# EasyEDA Pro project stm32f401rct6v1.eprj, board STM32F401RCT6V1B
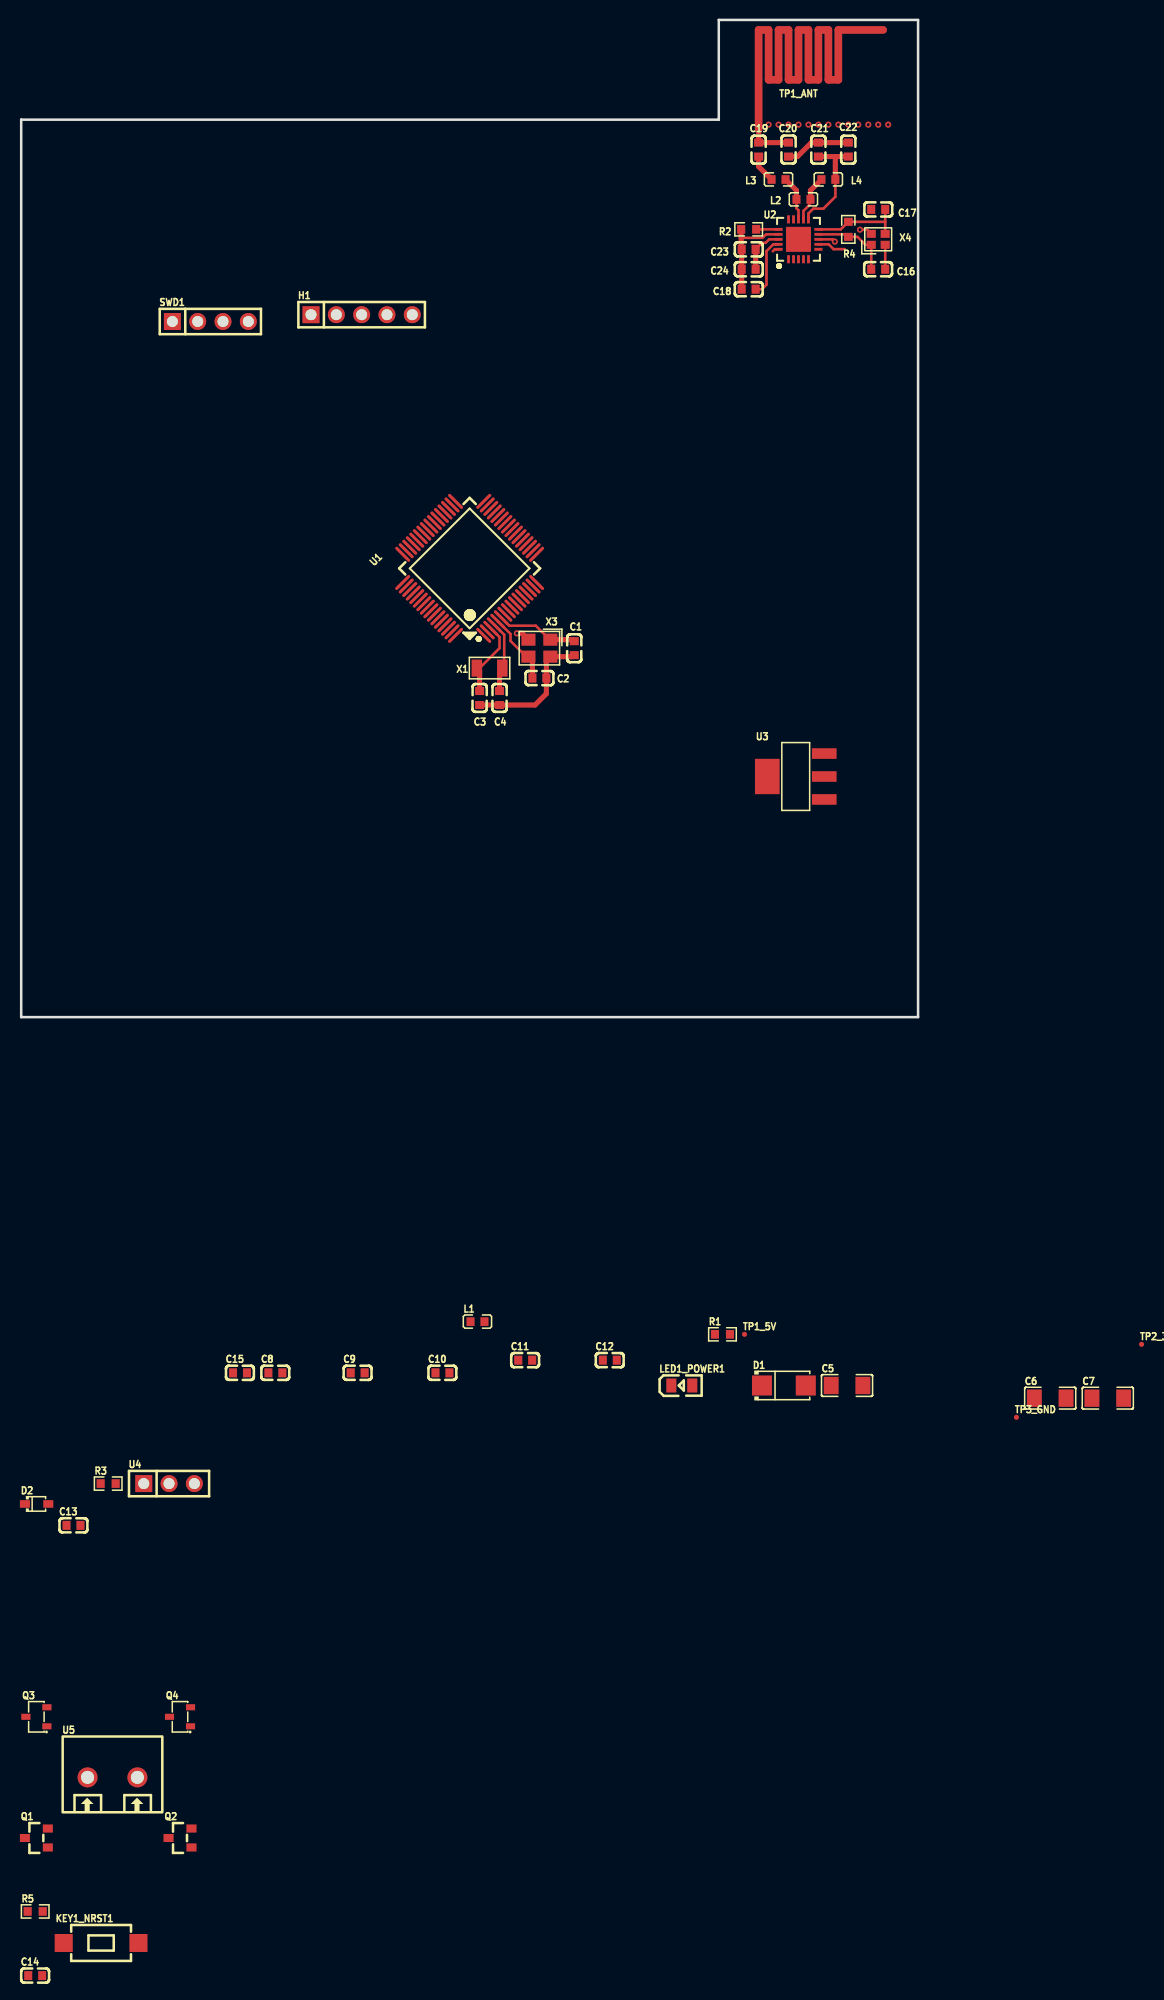
[diagram p5: board, top side]
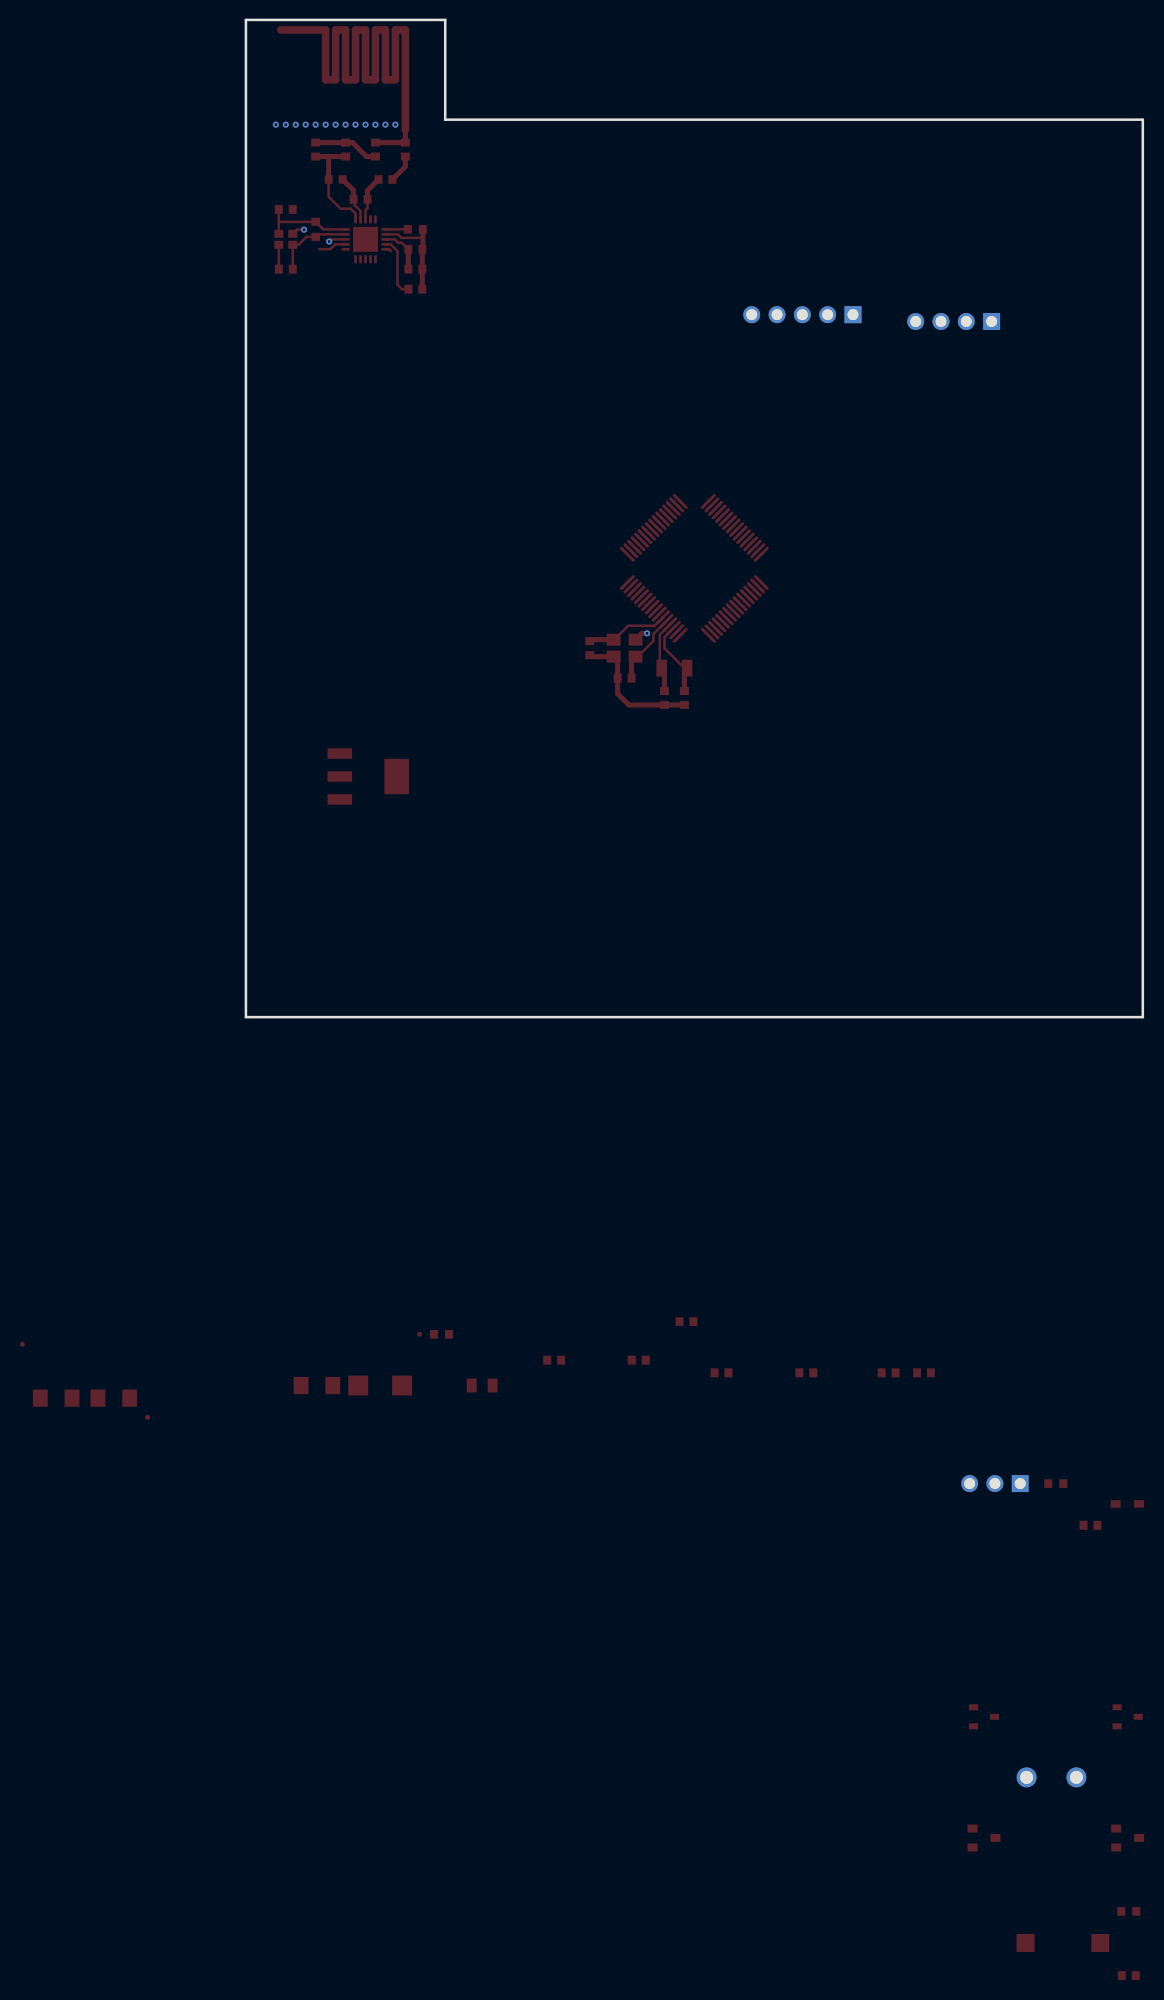
[diagram p6: board, bottom side, seen from below]

Outline 90 x 100 mm; copper layers: Top Layer, Bottom Layer. Coordinates in mm from the lower left corner of the outline.
Outline path: 0,90 70,90 70,100 90,100 90,0 0,0 0,90
Stack: Top Layer 0.035mm / Dielectric1 1.51mm FR4 er 4.5 / Bottom Layer 0.035mm

## Design rules (mm)
template: JLCPCB Capability(Two Layers Board)
spacing copperThickness1oz (default): track to track 0.102, other pairs 0.152 to 0.3
spacing copperThickness2oz: track to track 0.203, other pairs 0.152 to 0.3
track width copperThickness1oz (default): min 0.127, default 0.254, max 2.54
track width copperThickness2oz: min 0.203, default 0.254, max 2.54
differential pair differentialPair (default): width min 0.127, default 0.254, max 2.54; gap min 0.152, default 0.152
via viaSize (default): diameter min 0.5, default 0.61, max 10; hole min 0.3, default 0.305, max 6.3

## Placement (name value [footprint] x y rotation side)
C1  22pF  [C0603]  55.5 37 90 top
C2  22pF  [C0603]  52 34 180 top
C3  6pF  [C0603]  46 32 270 top
C4  6pF  [C0603]  48 32 270 top
C5  47uF  [C1206]  82.87 -36.94 0 top
C6  47uF  [C1206]  103.26 -38.21 0 top
C7  100nF  [C1206]  109.04 -38.21 0 top
C8  100nF  [C0603]  25.51 -35.67 0 top
C9  100nF  [C0603]  33.76 -35.67 0 top
C10  100nF  [C0603]  42.27 -35.67 0 top
C11  1uF  [C0603]  50.58 -34.4 0 top
C12  10nF  [C0603]  59.07 -34.4 0 top
C13  4.7uF  [C0603]  5.25 -50.97 0 top
C14  100nF  [C0603]  1.41 -96.12 0 top
C15  100nF  [C0603]  21.96 -35.67 0 top
C16  22pF  [C0603]  86 75 0 top
C17  22pF  [C0603]  86 81 180 top
C18  33nF  [C0603]  73 73 180 top
C19  1.5pF  [C0603]  74 87 90 top
C20  1pF  [C0603]  77 87 270 top
C21  4.7pF  [C0603]  80 87 90 top
C22  2.2nF  [C0603]  83 87 90 top
C23  10nF  [C0603]  73 77 180 top
C24  1nF  [C0603]  73 75 180 top
D1  SMAJ5.0A  [SMA_L4.3-W2.6-LS5.2-RD]  76.53 -36.94 0 top
D2  1N4148WS  [SOD-323_L1.8-W1.3-LS2.5-RD]  1.55 -48.82 0 top
H1  PZ254V-11-05P  [HDR-TH_5P-P2.54-V-M]  34.16 70.44 0 top
KEY1_NRST1  TC-3602-4.3-260G  [KEY-SMD_L6.0-W3.6-LS8.3-L]  8.02 -92.85 0 top
L1  CBG160808U000T  [L0603]  45.79 -30.54 0 top
L2  8.2nH  [L0603]  78.5 82 0 top
L3  3.9nH  [IND-SMD_L1.6-W0.8-1]  76 84 0 top
L4  2.7nH  [L0603]  81 84 0 top
LED1_POWER1  NCD0805R1  [LED0805-R-RD]  66.29 -36.94 0 top
Q1  AO3400  [SOT-23_L2.9-W1.3-P1.90-LS2.4-BR]  1.52 -82.32 0 top
Q2  AO3400  [SOT-23_L2.9-W1.3-P1.90-LS2.4-BR]  15.94 -82.32 0 top
Q3  AO3401  [SOT-23-3_L2.9-W1.4-P1.90-LS2.6-BR]  1.52 -70.17 0 top
Q4  AO3401  [SOT-23-3_L2.9-W1.4-P1.90-LS2.6-BR]  15.94 -70.17 0 top
R1  1kΩ  [R0603]  70.37 -31.81 0 top
R2  22kΩ  [R0603]  73 79 180 top
R3  10kΩ  [R0603]  8.73 -46.78 0 top
R4  1MΩ  [R0603]  83 79 90 top
R5  10kΩ  [R0603]  1.41 -89.69 0 top
SWD1  PZ254V-11-04P  [HDR-TH_4P-P2.54-V-M]  18.98 69.76 0 top
TP1_5V  -  [Test-Point-0.5mm]  72.58 -31.81 0 top
TP1_ANT  -  [Test-Point-0.5mm]  86.5 99 0 top
TP2_3V3  -  [Test-Point-0.5mm]  112.43 -32.81 0 top
TP3_GND  -  [Test-Point-0.5mm]  99.87 -40.13 0 top
U1  STM32F401RCT6  [LQFP-64_L10.0-W10.0-P0.50-LS12.0-BL]  45 45 45 top
U2  NRF24L01P-R  [QFN-20_L4.0-W4.0-P0.50-BL-EP]  78 78 0 top
U3  AMS1117-3.3  [SOT-223_L6.5-W3.5-P2.30-LS7.0-BR]  77.72 24.13 0 top
U4  GPHA101-0302A001A1BA  [HDR-TH_3P-P2.54-V-M]  14.84 -46.78 0 top
U5  DB301V-5.0-2P-BU-S  [CONN-TH_2P-P5.00_L7.6-W10.0]  9.16 -76.24 0 top
X1  32.768kHz  [OSC-SMD_L3.2-W1.5]  47 35 0 top
X3  25MHz  [CRYSTAL-SMD_4P-L3.2-W2.5-BL]  52 37 180 top
X4  16MHz  [CRYSTAL-SMD_4P-L2.0-W1.6-BL]  86 78 0 top

## Footprints (pads in the part's own frame, mm; a bottom-side part is the same pattern mirrored in y, then rotated)
C0603
  rect 0.8x0.9 smd: 1(-0.7,0) 2(0.7,0)
C1206
  rect 1.485x1.728 smd: 1(-1.593,0) 2(1.593,0)
CONN-TH_2P-P5.00_L7.6-W10.0
  round 2 hole 1.3: 1(-2.5,0) 2(2.5,0)
CRYSTAL-SMD_4P-L2.0-W1.6-BL
  rect 0.9x0.8 smd: 1(-0.7,-0.55) 2(0.7,-0.55) 3(0.7,0.55) 4(-0.7,0.55)
CRYSTAL-SMD_4P-L3.2-W2.5-BL
  rect 1.4x1.2 smd: 1(-1.1,-0.85) 2(1.1,-0.85) 3(1.1,0.85) 4(-1.1,0.85)
HDR-TH_3P-P2.54-V-M
  rect 1.7x1.7 hole 1.1: 1(-2.54,0)
  round 1.7 hole 1.1: 2(0,0) 3(2.54,0)
HDR-TH_4P-P2.54-V-M
  rect 1.7x1.7 hole 1.1: 1(-3.81,0)
  round 1.7 hole 1.1: 2(-1.27,0) 3(1.27,0) 4(3.81,0)
HDR-TH_5P-P2.54-V-M
  rect 1.7x1.7 hole 1.1: 1(-5.08,0)
  round 1.7 hole 1.1: 2(-2.54,0) 3(0,0) 4(2.54,0) 5(5.08,0)
IND-SMD_L1.6-W0.8-1
  rect 0.8x0.864 smd: 1(0.7,0) 2(-0.7,0)
KEY-SMD_L6.0-W3.6-LS8.3-L
  rect 1.8x1.8 smd: 1(-3.75,0) 2(3.75,0)
L0603
  rect 0.8x0.864 smd: 1(-0.7,0) 2(0.7,0)
LED0805-R-RD
  rect 1x1.399 smd: 1(1.05,0) 2(-1.05,0)
LQFP-64_L10.0-W10.0-P0.50-LS12.0-BL
  oval 0.3x2 smd: 1(-3.75,-5.75) 2(-3.25,-5.75) 3(-2.75,-5.75) 4(-2.25,-5.75) 5(-1.75,-5.75) 6(-1.25,-5.75) 7(-0.75,-5.75) 8(-0.25,-5.75) 9(0.25,-5.75) 10(0.75,-5.75) 11(1.25,-5.75) 12(1.75,-5.75) 13(2.25,-5.75) 14(2.75,-5.75) 15(3.25,-5.75) 16(3.75,-5.75) 33(3.75,5.75) 34(3.25,5.75) 35(2.75,5.75) 36(2.25,5.75) 37(1.75,5.75) 38(1.25,5.75) 39(0.75,5.75) 40(0.25,5.75) 41(-0.25,5.75) 42(-0.75,5.75) 43(-1.25,5.75) 44(-1.75,5.75) 45(-2.25,5.75) 46(-2.75,5.75) 47(-3.25,5.75) 48(-3.75,5.75)
  oval 2x0.3 smd: 17(5.75,-3.75) 18(5.75,-3.25) 19(5.75,-2.75) 20(5.75,-2.25) 21(5.75,-1.75) 22(5.75,-1.25) 23(5.75,-0.75) 24(5.75,-0.25) 25(5.75,0.25) 26(5.75,0.75) 27(5.75,1.25) 28(5.75,1.75) 29(5.75,2.25) 30(5.75,2.75) 31(5.75,3.25) 32(5.75,3.75) 49(-5.75,3.75) 50(-5.75,3.25) 51(-5.75,2.75) 52(-5.75,2.25) 53(-5.75,1.75) 54(-5.75,1.25) 55(-5.75,0.75) 56(-5.75,0.25) 57(-5.75,-0.25) 58(-5.75,-0.75) 59(-5.75,-1.25) 60(-5.75,-1.75) 61(-5.75,-2.25) 62(-5.75,-2.75) 63(-5.75,-3.25) 64(-5.75,-3.75)
OSC-SMD_L3.2-W1.5
  rect 1.05x1.7 smd: 1(-1.275,0) 2(1.275,0)
QFN-20_L4.0-W4.0-P0.50-BL-EP
  rect 0.28x0.8 smd: 1(-1,-2) 2(-0.5,-2) 3(0,-2) 4(0.5,-2) 5(1,-2) 11(1,2) 12(0.5,2) 13(0,2) 14(-0.5,2) 15(-1,2)
  rect 0.8x0.28 smd: 6(2,-1) 7(2,-0.5) 8(2,0) 9(2,0.5) 10(2,1) 16(-2,1) 17(-2,0.5) 18(-2,0) 19(-2,-0.5) 20(-2,-1)
  rect 2.5x2.5 smd: 21(0,0)
R0603
  rect 0.806x0.864 smd: 1(-0.753,0) 2(0.753,0)
SMA_L4.3-W2.6-LS5.2-RD
  rect 2x2 smd: 1(-2.2,0) 2(2.2,0)
SOD-323_L1.8-W1.3-LS2.5-RD
  rect 1x0.75 smd: 1(-1.173,0) 2(1.173,0)
SOT-23-3_L2.9-W1.4-P1.90-LS2.6-BR
  rect 0.91x0.6 smd: 1(1.055,-0.955) 2(1.055,0.955) 3(-1.055,0)
SOT-23_L2.9-W1.3-P1.90-LS2.4-BR
  rect 1x0.8 smd: 1(1.15,-0.95) 2(1.15,0.95) 3(-1.15,0)
SOT-223_L6.5-W3.5-P2.30-LS7.0-BR
  rect 2.465x1.05 smd: 1(2.857,-2.3) 2(2.857,0) 3(2.857,2.3)
  rect 2.465x3.54 smd: 4(-2.857,0)
Test-Point-0.5mm
  round 0.5 smd: 1(0,0)

## Nets
As in the schematic.

Pads without a net: U1 2 8 9 10 11 14 15 16 17 20 24 25 29 33 34 35 36 37 38 39 40 41 44 45 50 54 55 56 57 58 59 61 62; U2 21

## Via types
v1: diameter 0.61, hole 0.305, Top Layer to Bottom Layer, 16 vias

## Routing (per net, layer and track width the routed paths; a pad name or vN(x,y) marks a point on that pad's centre or on a via; arc(x,y) is an arc through that point)
3V3: length 7.6
  Top Layer w0.254: 82.65,77.01 81.52,77.01 81.03,77.5 U2.7 ; U2.18 75.06,78 74.71,77.65 74.35,77.65 C23.1
  Top Layer w0.508: C23.1 C24.1
GND: length 37.6
  Top Layer w0.254: 75.42,76.8 75.62,77 U2.20 ; X4.4 84.88,78.97 v1(84.17,78.97) ; U2.8 81.42,78 v1(81.65,77.78) ; U2.17 74.75,78.5 74.4,78.15 72.25,78.15 ; X4.2 C16.2 ; 55.35,36.15 C1.1
  Top Layer w0.508: X3.2 50.26,38.48 v1(49.74,38.48) ; C3.2 C4.2 51.57,31.3 52.7,32.43 C2.1 52.7,35.75 X3.4 55.35,36.15 ; C18.2 C24.2 C23.2 72.25,77.05 R2.2 ; C22.2 C21.2 79.3,87.7 77.9,86.3 C20.2
(no net):
  vias: v1(75,89.5) v1(76,89.5) v1(77,89.5) v1(78,89.5) v1(79,89.5) v1(80,89.5) v1(81,89.5) v1(82,89.5) v1(83,89.5) v1(84,89.5) v1(85,89.5) v1(86,89.5) v1(87,89.5)
ANT: length 66.8
  Top Layer w0.508: 74,89 C19.2 C20.1
  Top Layer w0.762: TP1_ANT.1 82,99 82,94 81,94 81,99 80,99 80,94 79,94 79,99 78,99 78,94 77,94 77,99 76,99 76,94 75,94 75,99 74,99 74,89
NRF24L01_ANT1: length 4.7
  Top Layer w0.254: L2.2 79.11,81.91 79.11,81.46 78.5,80.85 U2.12
  Top Layer w0.508: L2.2 79.2,82.9 L4.1
NRF24L01_ANT2: length 4.5
  Top Layer w0.254: L2.1 77.8,81.11 78,80.91 U2.13
  Top Layer w0.508: L3.1 77.8,82.9 L2.1
NRF24L01_DVDD: length 6.1
  Top Layer w0.254: C18.1 74.33,73 74.79,73.46 74.79,76.81 75.47,77.5 U2.19
NRF24L01_IREF: length 2.2
  Top Layer w0.254: U2.16 R2.1
NRF24L01_VDD_PA: length 11
  Top Layer w0.254: U2.11 79,80.59 79.49,81.08 80.5,81.08 81.7,82.27 L4.2
  Top Layer w0.508: L4.2 81.7,86.3 81.7,86.3 ; C21.1 81.7,86.3 ; 81.7,86.3 C22.1
NRF24L01_XC1: length 9.5
  Top Layer w0.254: 86.7,79.75 C17.1 ; 86.7,79.75 X4.3 ; 86.7,79.75 R4.2 82.25,79 U2.10
NRF24L01_XC2: length 8.2
  Top Layer w0.254: C16.1 X4.1 84.72,77.45 83.93,78.25 R4.1 82.75,78.5 U2.9
OSC32_IN: length 7.9
  Top Layer w0.254: X1.1 46,35 48,37 48,38.11 47.12,38.99
  Top Layer w0.508: X1.1 46,34.72 C3.1
OSC32_OUT: length 7.2
  Top Layer w0.254: X1.2 48.47,35.19 48.47,38.35 47.47,39.34
  Top Layer w0.508: X1.2 48,34.72 C4.1
OSC_IN: length 7.3
  Top Layer w0.254: U1.5 49.1,38.42 49.1,37.72 50.68,36.15 X3.3
  Top Layer w0.508: C2.2 51.3,35.75 X3.3
OSC_OUT: length 8.3
  Top Layer w0.254: U1.6 48.99,39.25 51.64,39.25 53.04,37.85 X3.1
  Top Layer w0.508: C1.2 55.35,37.85 X3.1
$2N1086: length 2.8
  Top Layer w0.508: L3.2 74,85.3 C19.1
